# Altium schematic sheet bme_affect.SchDoc
size A4; SheetNumber: 1; SheetTotal: 7
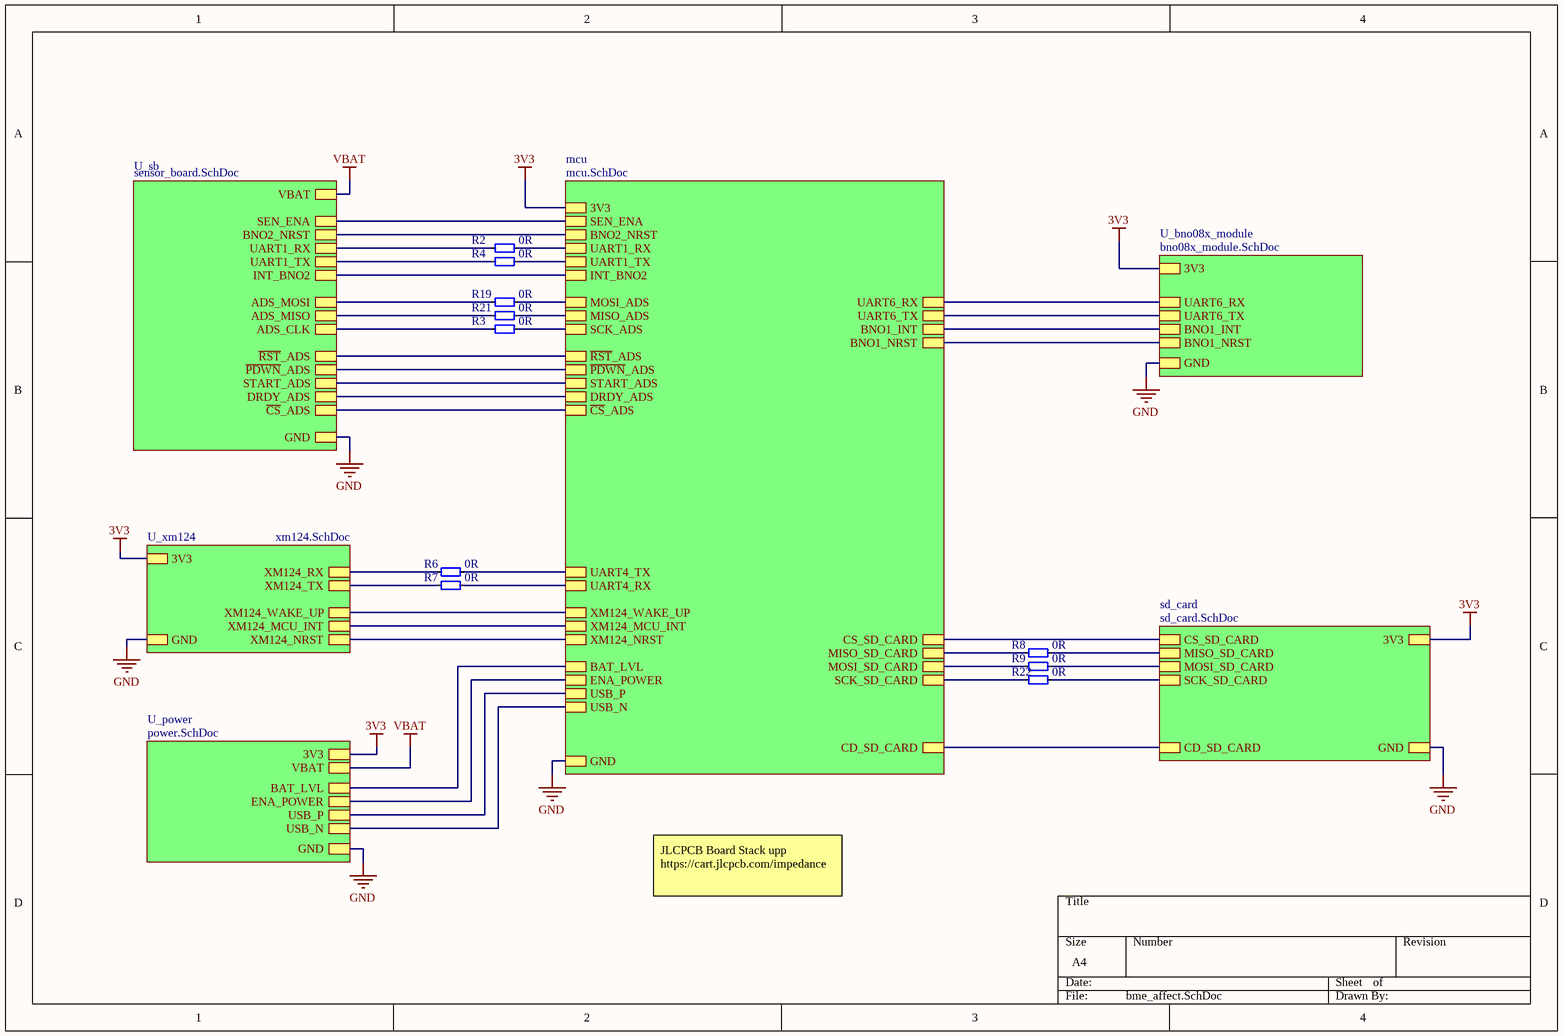
[diagram p0: bme_affect.SchDoc]

## Parts
R2  value 0R  [0402 res]  (hidden comment: 0603, resistor)
R3  value 0R  [0402 res]  (hidden comment: 0603, resistor)
R4  value 0R  [0402 res]  (hidden comment: 0603, resistor)
R6  value 0R  [0402 res]  (hidden comment: 0603, resistor)
R7  value 0R  [0402 res]  (hidden comment: 0603, resistor)
R8  value 0R  [0402 res]  (hidden comment: 0603, resistor)
R9  value 0R  [0402 res]  (hidden comment: 0603, resistor)
R19  value 0R  [0402 res]  (hidden comment: 0603, resistor)
R21  value 0R  [0402 res]  (hidden comment: 0603, resistor)
R22  value 0R  [0402 res]  (hidden comment: 0603, resistor)

## Sub-sheets
mcu = mcu.SchDoc: 3V3, GND, SCK_SD_CARD, MISO_SD_CARD, ~{CS}_ADS, MOSI_SD_CARD, CS_SD_CARD, ~{RST}_ADS, START_ADS, ~{PDWN}_ADS, CD_SD_CARD, USB_N, USB_P, MISO_ADS, DRDY_ADS, SCK_ADS, MOSI_ADS, UART6_RX, UART6_TX, INT_BNO2, UART1_RX, UART1_TX, BNO1_INT, BNO1_NRST, BNO2_NRST, XM124_NRST, XM124_MCU_INT, XM124_WAKE_UP, UART4_TX, UART4_RX, ENA_POWER, BAT_LVL, SEN_ENA
sd_card = sd_card.SchDoc: CS_SD_CARD, MISO_SD_CARD, MOSI_SD_CARD, SCK_SD_CARD, 3V3, GND, CD_SD_CARD
U_bno08x_module = bno08x_module.SchDoc: 3V3, GND, BNO1_INT, BNO1_NRST, UART6_RX, UART6_TX
U_power = power.SchDoc: GND, 3V3, VBAT, USB_N, USB_P, ENA_POWER, BAT_LVL
U_sb = sensor_board.SchDoc: ~{CS}_ADS, ADS_CLK, ADS_MISO, ADS_MOSI, DRDY_ADS, START_ADS, ~{RST}_ADS, ~{PDWN}_ADS, GND, VBAT, INT_BNO2, UART1_RX, UART1_TX, BNO2_NRST, SEN_ENA
U_xm124 = xm124.SchDoc: GND, 3V3, XM124_RX, XM124_TX, XM124_NRST, XM124_MCU_INT, XM124_WAKE_UP

## Nets
3V3: sheet sd_card/3V3, sheet mcu/3V3, sheet U_power/3V3, sheet U_xm124/3V3, sheet U_bno08x_module/3V3
GND: sheet sd_card/GND, sheet mcu/GND, sheet U_power/GND, sheet U_xm124/GND, sheet U_sb/GND, sheet U_bno08x_module/GND
VBAT: sheet U_power/VBAT, sheet U_sb/VBAT
NetR2_0: R2.0 ; sheet mcu/UART1_RX
NetR2_1: R2.1 ; sheet U_sb/UART1_RX
NetR3_0: R3.0 ; sheet mcu/SCK_ADS
NetR3_1: R3.1 ; sheet U_sb/ADS_CLK
NetR4_0: R4.0 ; sheet mcu/UART1_TX
NetR4_1: R4.1 ; sheet U_sb/UART1_TX
NetR6_0: R6.0 ; sheet mcu/UART4_TX
NetR6_1: R6.1 ; sheet U_xm124/XM124_RX
NetR7_0: R7.0 ; sheet mcu/UART4_RX
NetR7_1: R7.1 ; sheet U_xm124/XM124_TX
NetR8_0: R8.0 ; sheet sd_card/MISO_SD_CARD
NetR8_1: R8.1 ; sheet mcu/MISO_SD_CARD
NetR9_0: R9.0 ; sheet sd_card/MOSI_SD_CARD
NetR9_1: R9.1 ; sheet mcu/MOSI_SD_CARD
NetR19_0: R19.0 ; sheet mcu/MOSI_ADS
NetR19_1: R19.1 ; sheet U_sb/ADS_MOSI
NetR21_0: R21.0 ; sheet mcu/MISO_ADS
NetR21_1: R21.1 ; sheet U_sb/ADS_MISO
NetR22_0: R22.0 ; sheet sd_card/SCK_SD_CARD
NetR22_1: R22.1 ; sheet mcu/SCK_SD_CARD
(unnamed): sheet sd_card/CS_SD_CARD, sheet mcu/CS_SD_CARD
(unnamed): sheet sd_card/CD_SD_CARD, sheet mcu/CD_SD_CARD
(unnamed): sheet mcu/~{CS}_ADS, sheet U_sb/~{CS}_ADS
(unnamed): sheet mcu/~{RST}_ADS, sheet U_sb/~{RST}_ADS
(unnamed): sheet mcu/START_ADS, sheet U_sb/START_ADS
(unnamed): sheet mcu/~{PDWN}_ADS, sheet U_sb/~{PDWN}_ADS
(unnamed): sheet mcu/USB_N, sheet U_power/USB_N
(unnamed): sheet mcu/USB_P, sheet U_power/USB_P
(unnamed): sheet mcu/DRDY_ADS, sheet U_sb/DRDY_ADS
(unnamed): sheet mcu/UART6_RX, sheet U_bno08x_module/UART6_RX
(unnamed): sheet mcu/UART6_TX, sheet U_bno08x_module/UART6_TX
(unnamed): sheet mcu/INT_BNO2, sheet U_sb/INT_BNO2
(unnamed): sheet mcu/BNO1_INT, sheet U_bno08x_module/BNO1_INT
(unnamed): sheet mcu/BNO1_NRST, sheet U_bno08x_module/BNO1_NRST
(unnamed): sheet mcu/BNO2_NRST, sheet U_sb/BNO2_NRST
(unnamed): sheet mcu/XM124_NRST, sheet U_xm124/XM124_NRST
(unnamed): sheet mcu/XM124_MCU_INT, sheet U_xm124/XM124_MCU_INT
(unnamed): sheet mcu/XM124_WAKE_UP, sheet U_xm124/XM124_WAKE_UP
(unnamed): sheet mcu/ENA_POWER, sheet U_power/ENA_POWER
(unnamed): sheet mcu/BAT_LVL, sheet U_power/BAT_LVL
(unnamed): sheet mcu/SEN_ENA, sheet U_sb/SEN_ENA

## Notes on the sheet
- JLCPCB Board Stack upp
  https://cart.jlcpcb.com/impedance

## Library data of the parts
R2-R4 R6-R9 R19 R21 R22 = 0603, resistor: Manufacturer Part No: RMCF0402ZT0R00